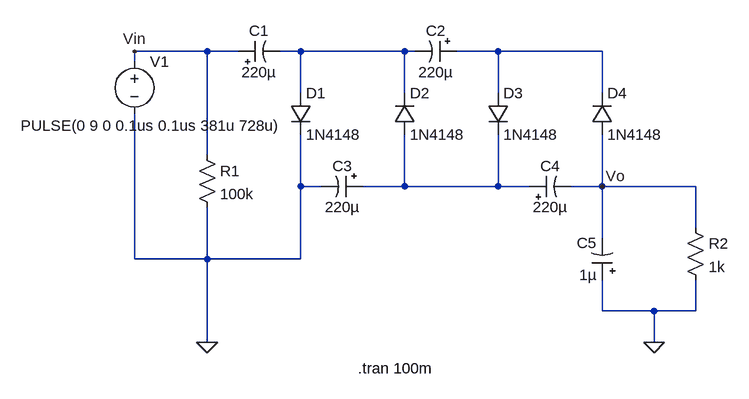
[diagram p0: schematic Villard_Cascade_Negtive_Voltage_Multiplier.asc]
Villard_Cascade_Negtive_Voltage_Multiplier.asc, the LTspice schematic file:
Version 4
SHEET 1 928 680
WIRE 96 128 -16 128
WIRE 144 128 96 128
WIRE 240 128 208 128
WIRE 400 128 240 128
WIRE 416 128 400 128
WIRE 544 128 480 128
WIRE 704 128 544 128
WIRE -16 144 -16 128
WIRE 240 192 240 128
WIRE 400 192 400 128
WIRE 544 192 544 128
WIRE 704 192 704 128
WIRE 96 288 96 128
WIRE 240 336 240 256
WIRE 272 336 240 336
WIRE 400 336 400 256
WIRE 400 336 336 336
WIRE 544 336 544 256
WIRE 544 336 400 336
WIRE 592 336 544 336
WIRE 704 336 704 256
WIRE 704 336 656 336
WIRE 848 336 704 336
WIRE 848 400 848 336
WIRE 704 416 704 336
WIRE -16 448 -16 224
WIRE 96 448 96 368
WIRE 96 448 -16 448
WIRE 240 448 240 336
WIRE 240 448 96 448
WIRE 704 528 704 480
WIRE 784 528 704 528
WIRE 848 528 848 480
WIRE 848 528 784 528
WIRE 96 576 96 448
WIRE 784 576 784 528
FLAG 96 576 0
FLAG 704 336 Vo
FLAG -16 128 Vin
FLAG 784 576 0
SYMBOL voltage -16 128 R0
WINDOW 123 0 0 Left 0
WINDOW 39 0 0 Left 0
WINDOW 3 -175 114 Left 2
SYMATTR Value PULSE(0 9 0 0.1us 0.1us 381u 728u)
SYMATTR InstName V1
SYMBOL polcap 144 144 R270
WINDOW 0 32 32 VTop 2
WINDOW 3 0 32 VBottom 2
SYMATTR InstName C1
SYMATTR Value 220µ
SYMBOL polcap 480 112 R90
WINDOW 0 0 32 VBottom 2
WINDOW 3 32 32 VTop 2
SYMATTR InstName C2
SYMATTR Value 220µ
SYMBOL polcap 336 320 R90
WINDOW 0 0 32 VBottom 2
WINDOW 3 32 32 VTop 2
SYMATTR InstName C3
SYMATTR Value 220µ
SYMBOL polcap 592 352 R270
WINDOW 0 32 32 VTop 2
WINDOW 3 0 32 VBottom 2
SYMATTR InstName C4
SYMATTR Value 220µ
SYMBOL diode 224 192 R0
SYMATTR InstName D1
SYMATTR Value 1N4148
SYMBOL diode 384 256 M180
WINDOW 0 24 64 Left 2
WINDOW 3 24 0 Left 2
SYMATTR InstName D2
SYMATTR Value 1N4148
SYMBOL diode 528 192 R0
SYMATTR InstName D3
SYMATTR Value 1N4148
SYMBOL diode 688 256 M180
WINDOW 0 24 64 Left 2
WINDOW 3 24 0 Left 2
SYMATTR InstName D4
SYMATTR Value 1N4148
SYMBOL res 80 272 R0
SYMATTR InstName R1
SYMATTR Value 100k
SYMBOL polcap 720 480 R180
WINDOW 0 24 57 Left 2
WINDOW 3 24 8 Left 2
SYMATTR InstName C5
SYMATTR Value 1µ
SYMBOL res 832 384 R0
SYMATTR InstName R2
SYMATTR Value 1k
TEXT 328 616 Left 2 !.tran 100m

The netlist it stands for:
* Villard_Cascade_Negtive_Voltage_Multiplier.asc
V1 Vin 0 PULSE(0 9 0 0.1us 0.1us 381u 728u)
C1 Vin N001 220µ
C2 N002 N001 220µ
C3 N003 0 220µ
C4 N003 Vo 220µ
D1 N001 0 1N4148
D2 N003 N001 1N4148
D3 N002 N003 1N4148
D4 Vo N002 1N4148
R1 Vin 0 100k
C5 0 Vo 1µ
R2 Vo 0 1k
.model D D
.lib standard.dio
.tran 100m
.backanno
.end

* Results of the author's LTspice run, read from the files saved beside the schematic
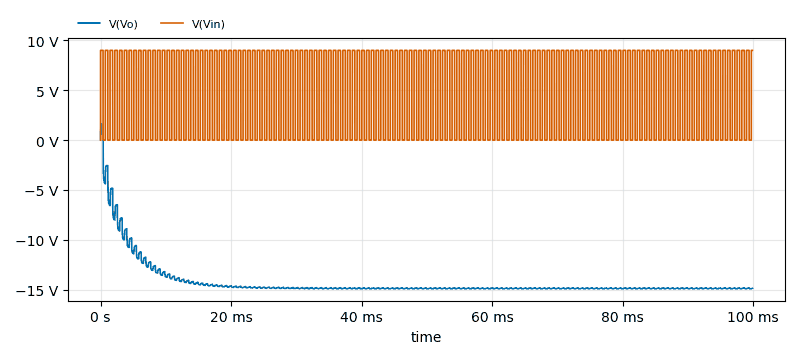
[diagram p1: Transient Analysis of Villard_Cascade_Negtive_Voltage_Multiplier.asc, plotted from the saved traces]
* Transient Analysis, 1 run:
*   V(Vo): min -14.91 V, max 1.644 V, average -14.28 V, rms 14.42 V, last -14.83 V
*   V(Vin): min 0 V, max 9 V, average 4.723 V, rms 6.519 V, last 9 V